# Altium schematic sheet SEP00949AG.SCHDOC
size A3; PageSetup: Record=PageOptions|CenterHorizontal=True|CenterVertical=True|PrintScale=0.73|XCorrection=1.00|YCorrection=1.00|PrintKind=0|BorderSize=5000000|LeftOffset=0|BottomOffset=0|Orientation=2|PaperLength=1000|PaperWidth=1000|Scale=100|PaperSource=7|PrintQuality=-4|MediaType=1|DitherType=10|PaperKind=A4|PrintScaleMode=1
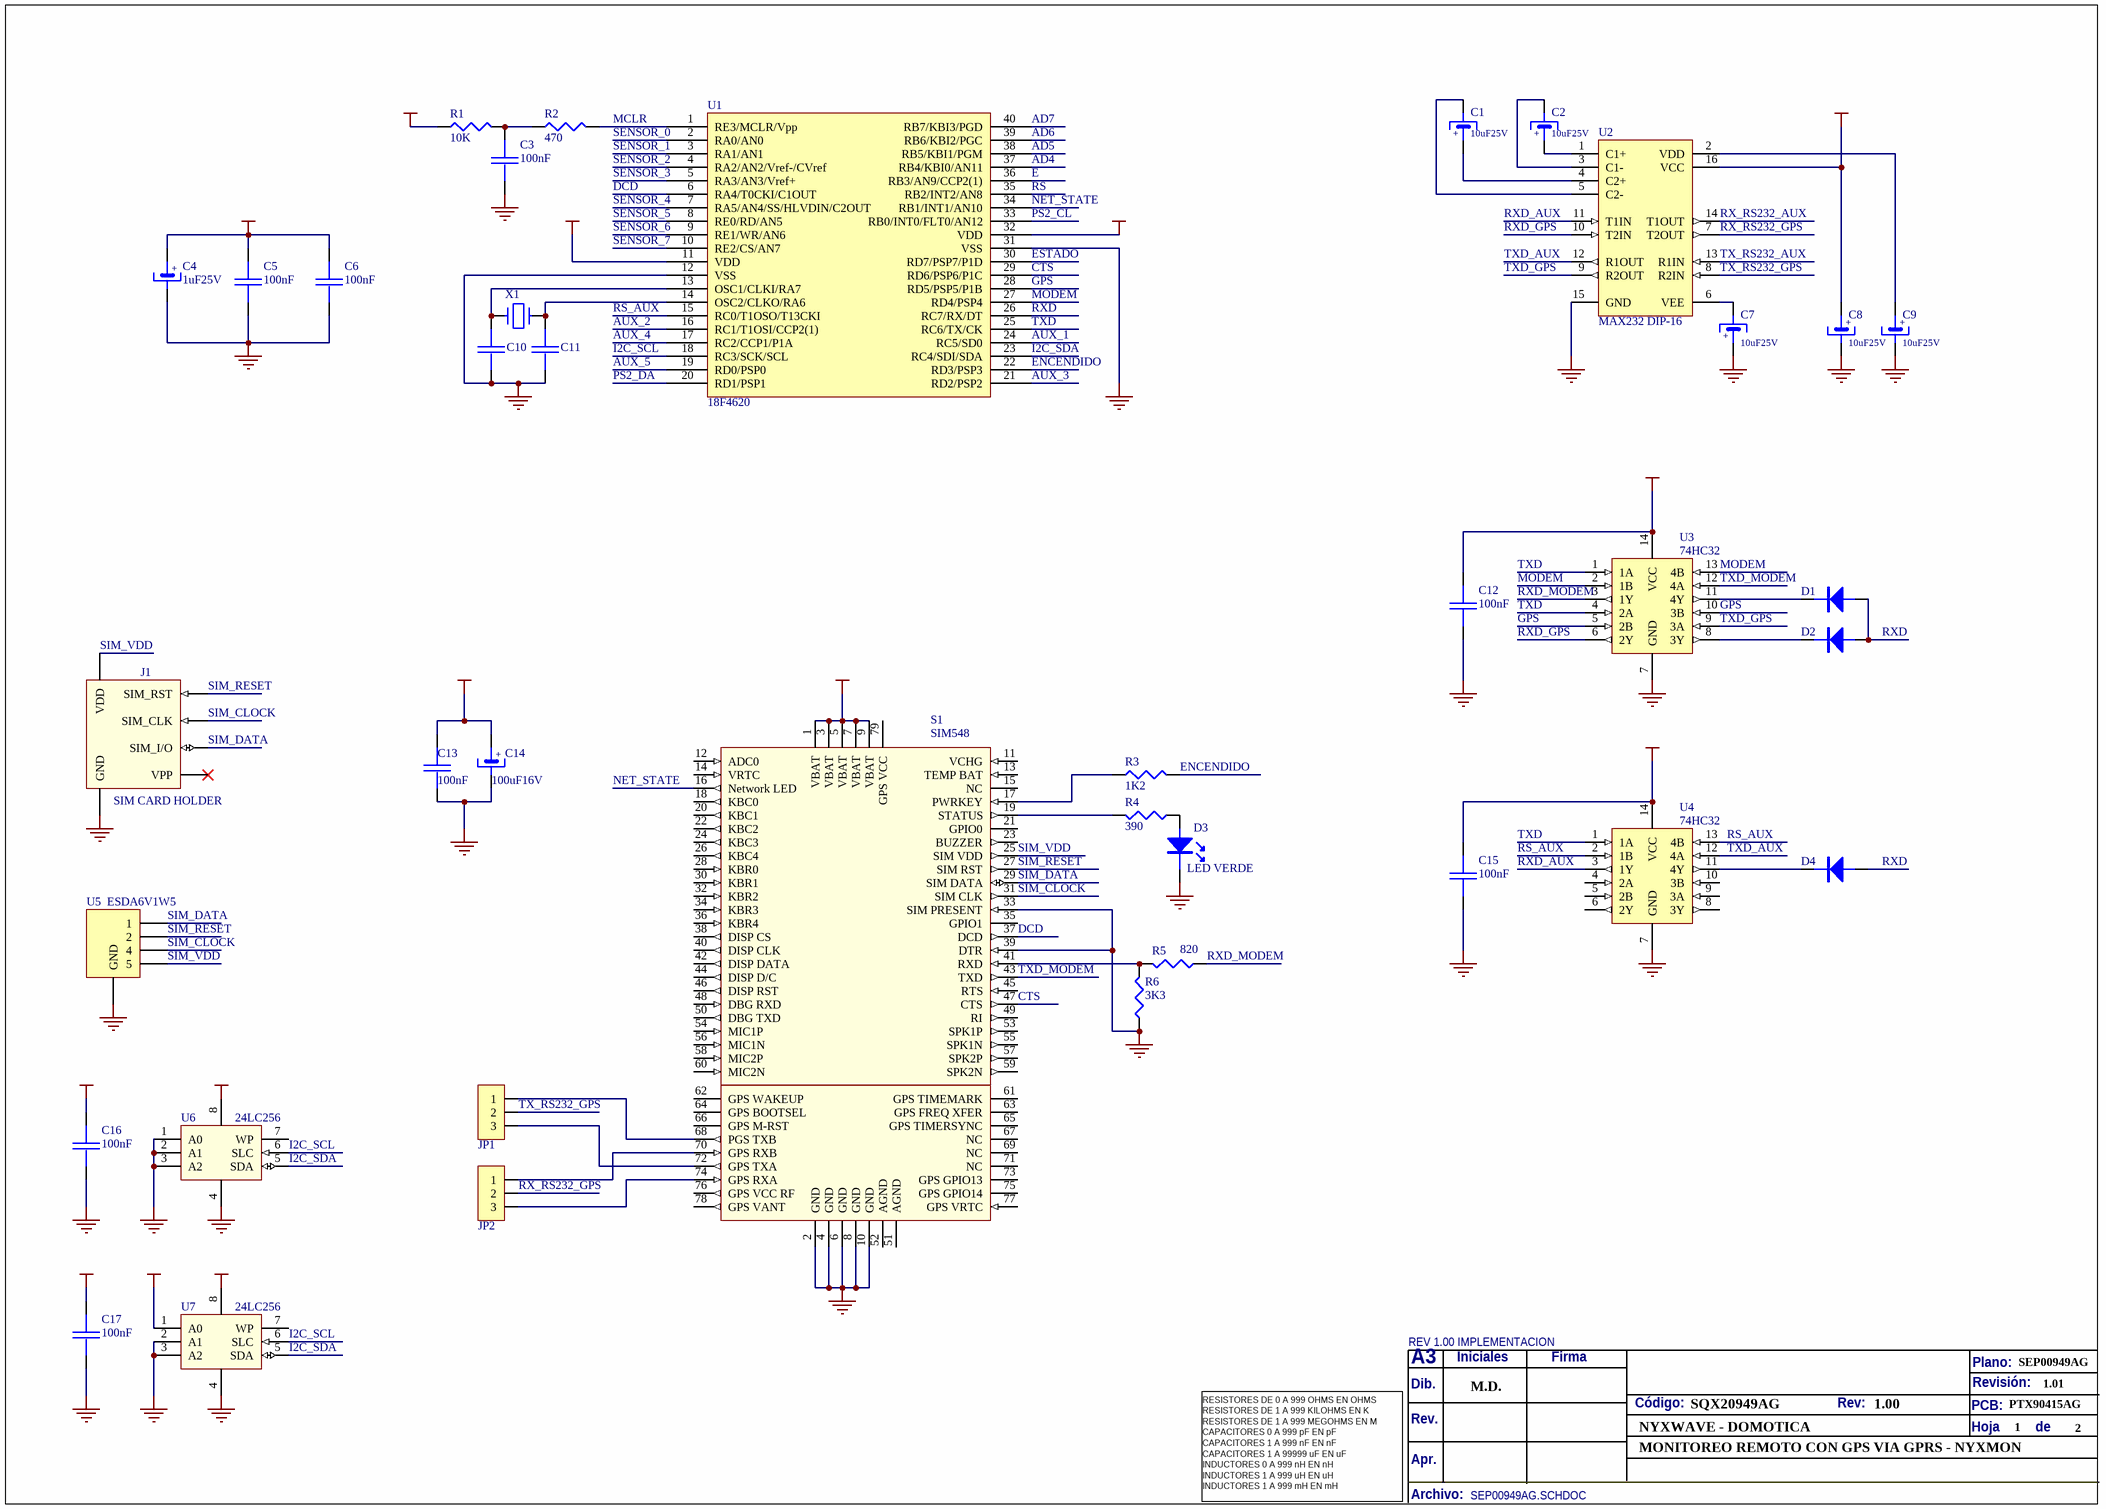
[diagram p0: SEP00949AG.SCHDOC]

## Parts
C1  10uF25V  [CE 2.0/5.0]
C2  10uF25V  [CE 2.0/5.0]
C3  100nF  [0805]
C4  1uF25V  [CE 2.5/5.0]
C5  100nF  [0805]
C6  100nF  [0805]
C7  10uF25V  [CE 2.0/5.0]
C8  10uF25V  [CE 2.0/5.0]
C9  10uF25V  [CE 2.0/5.0]
C10  15p  [CAP2.54]  (value not drawn)
C11  15p  [CAP2.54]  (value not drawn)
C12  100nF  [0805]
C13  100nF  [0805]
C14  100uF16V  [CE 3.5/8.0]
C15  100nF  [0805]
C16  100nF  [0805]
C17  100nF  [0805]
D1  1N4148 DO-35  [DO-35_200]  (value not drawn)
D2  1N4148 DO-35  [DO-35_200]  (value not drawn)
D3  LED VERDE  [LED 3MM]
D4  1N4148 DO-35  [DO-35_200]  (value not drawn)
J1  SIM CARD HOLDER  [SIM CARD HOLDER]
JP1  HEADER3  [JUMPER_3]  (value not drawn)
JP2  HEADER3  [JUMPER_3]  (value not drawn)
R1  10K  [RES_MF1/2W_200]
R2  470  [RES_MF1/2W_200]
R3  1K2  [0805]
R4  390  [RES_MF1/2W_200]
R5  820  [RES_MF1/2W_200]
R6  3K3  [RES_MF1/2W_200]
S1  SIM548  [SIM548]
U1  18F4620  [DIP40]
U2  MAX232 DIP-16  [DIP16]
U3  74HC32  [DIP14]
U4  74HC32  [DIP14]
U5  ESDA6V1W5  [SOT-323-5L]
U6  24LC256  [DIP8]
U7  24LC256  [DIP8]
X1  20MHz  [UM5]  (value not drawn)

## Nets
+5V: C8.1 C12.1 C15.1 C16.2 C17.2 R1.1 U2.16(VCC) U3.14(VCC) U4.14(VCC) U6.8(VCC) U7.1(A0) U7.8(VCC)
GND: C3.1 C4.2 C5.2 C6.1 C7.1 C8.2 C9.2 C10.1 C11.1 C12.2 C13.1 C14.2 C15.2 C16.1 C17.1 D3.K J1.4(GND) R6.1 S1.2(GND) S1.4(GND) S1.6(GND) S1.8(GND) S1.10(GND) S1.33(SIM_PRESENT) S1.39(DTR) U1.12(VSS) U1.31(VSS) U2.15(GND) U3.7(GND) U4.7(GND) U5.3(GND) U6.1(A0) U6.2(A1) U6.3(A2) U6.4(VSS) U7.2(A1) U7.3(A2) U7.4(VSS)
VBAT: C13.2 C14.1 S1.1(VBAT) S1.3(VBAT) S1.5(VBAT) S1.7(VBAT) S1.9(VBAT)
VDD: C4.1 C5.1 C6.2 U1.11(VDD) U1.32(VDD)
AD4: U1.37(RB4/KBI0/AN11)
AD5: U1.38(RB5/KBI1/PGM)
AD6: U1.39(RB6/KBI2/PGC)
AD7: U1.40(RB7/KBI3/PGD)
AUX_1: U1.24(RC5/SD0)
AUX_2: U1.16(RC1/T1OSI/CCP2(1))
AUX_3: U1.21(RD2/PSP2)
AUX_4: U1.17(RC2/CCP1/P1A)
AUX_5: U1.19(RD0/PSP0)
CTS: S1.47(CTS) U1.29(RD6/PSP6/P1C)
DCD: S1.37(DCD) U1.6(RA4/T0CKI/C1OUT)
E: U1.36(RB3/AN9/CCP2(1))
ENCENDIDO: R3.2 U1.22(RD3/PSP3)
ESTADO: U1.30(RD7/PSP7/P1D)
GPS: U1.28(RD5/PSP5/P1B) U3.5(2B) U3.10(3B)
I2C_SCL: U1.18(RC3/SCK/SCL) U6.6(SLC) U7.6(SLC)
I2C_SDA: U1.23(RC4/SDI/SDA) U6.5(SDA) U7.5(SDA)
MCLR: R2.2 U1.1(RE3/MCLR/Vpp)
MODEM: U1.27(RD4/PSP4) U3.2(1B) U3.13(4B)
NET_STATE: S1.16(Network_LED) U1.34(RB1/INT1/AN10)
PS2_CL: U1.33(RB0/INT0/FLT0/AN12)
PS2_DA: U1.20(RD1/PSP1)
RS: U1.35(RB2/INT2/AN8)
RS_AUX: U1.15(RC0/T1OSO/T13CKI) U4.2(1B) U4.13(4B)
RX_RS232_AUX: U2.14(T1OUT)
RX_RS232_GPS: JP2.2 U2.7(T2OUT)
RXD: D1.A D2.A D4.A U1.26(RC7/RX/DT)
RXD_AUX: U2.11(T1IN) U4.3(1Y)
RXD_GPS: U2.10(T2IN) U3.6(2Y)
RXD_MODEM: R5.1 U3.3(1Y)
SENSOR_0: U1.2(RA0/AN0)
SENSOR_1: U1.3(RA1/AN1)
SENSOR_2: U1.4(RA2/AN2/Vref-/CVref)
SENSOR_3: U1.5(RA3/AN3/Vref+)
SENSOR_4: U1.7(RA5/AN4/SS/HLVDIN/C2OUT)
SENSOR_5: U1.8(RE0/RD/AN5)
SENSOR_6: U1.9(RE1/WR/AN6)
SENSOR_7: U1.10(RE2/CS/AN7)
SIM_CLOCK: J1.3(SIM_CLK) S1.31(SIM_CLK) U5.4
SIM_DATA: J1.6(SIM_I/O) S1.29(SIM_DATA) U5.1
SIM_RESET: J1.2(SIM_RST) S1.27(SIM_RST) U5.2
SIM_VDD: J1.1(VDD) S1.25(SIM_VDD) U5.5
TX_RS232_AUX: U2.13(R1IN)
TX_RS232_GPS: JP1.2 U2.8(R2IN)
TXD: U1.25(RC6/TX/CK) U3.1(1A) U3.4(2A) U4.1(1A)
TXD_AUX: U2.12(R1OUT) U4.12(4A)
TXD_GPS: U2.9(R2OUT) U3.9(3A)
TXD_MODEM: S1.43(TXD) U3.12(4A)
NetC1_1: C1.1 U2.4(C2+)
NetC1_2: C1.2 U2.5(C2-)
NetC2_1: C2.1 U2.1(C1+)
NetC2_2: C2.2 U2.3(C1-)
NetC3_2: C3.2 R1.2 R2.1
NetC7_2: C7.2 U2.6(VEE)
NetC9_1: C9.1 U2.2(VDD)
NetC10_2: C10.2 U1.13(OSC1/CLKI/RA7) X1.2
NetC11_2: C11.2 U1.14(OSC2/CLKO/RA6) X1.1
NetD1_K: D1.K U3.11(4Y)
NetD2_K: D2.K U3.8(3Y)
NetD3_A: D3.A R4.1
NetD4_K: D4.K U4.11(4Y)
NetJP1_1: JP1.1 S1.68(PGS_TXB)
NetJP1_3: JP1.3 S1.72(GPS_TXA)
NetJP2_1: JP2.1 S1.70(GPS_RXB)
NetJP2_3: JP2.3 S1.74(GPS_RXA)
NetR3_1: R3.1 S1.17(PWRKEY)
NetR4_2: R4.2 S1.19(STATUS)
NetR5_2: R5.2 R6.2 S1.41(RXD)

Not connected (* = marked no-connect by the designer): J1 5(VPP)*; S1 11(VCHG) 12(ADC0) 13(TEMP_BAT) 14(VRTC) 15(NC) 18(KBC0) 20(KBC1) 21(GPIO0) 22(KBC2) 23(BUZZER) 24(KBC3) 26(KBC4) 28(KBR0) 30(KBR1) 32(KBR2) 34(KBR3) 35(GPIO1) 36(KBR4) 38(DISP_CS) 40(DISP_CLK) 42(DISP_DATA) 44(DISP_D/C) 45(RTS) 46(DISP_RST) 48(DBG_RXD) 49(RI) 50(DBG_TXD) 51(AGND) 52(AGND) 53(SPK1P) 54(MIC1P) 55(SPK1N) 56(MIC1N) 57(SPK2P) 58(MIC2P) 59(SPK2N) 60(MIC2N) 61(GPS_TIMEMARK) 62(GPS_WAKEUP) 63(GPS_FREQ_XFER) 64(GPS_BOOTSEL) 65(GPS_TIMERSYNC) 66(GPS_M-RST) 67(NC) 69(NC) 71(NC) 73(GPS_GPIO13) 75(GPS_GPIO14) 76(GPS_VCC_RF) 77(GPS_VRTC) 78(GPS_VANT) 79(GPS_VCC); U4 4(2A) 5(2B) 6(2Y) 8(3Y) 9(3A) 10(3B); U6 7(WP); U7 7(WP)

## Notes on the sheet
- Labels drawn without touching a wire or pin: 1, 1.00, 1.01, 2, M.D., MONITOREO REMOTO CON GPS VIA GPRS - NYXMON, PTX90415AG, SEP00949AG, SQX20949AG
- REV 1.00 IMPLEMENTACION
- Dib.
- A3
- Iniciales
- Firma
- Plano:
- Revisión:
- Rev.
- Apr.
- Código:
- Rev:
- Hoja          de
- PCB:
- RESISTORES DE 0 A 999 OHMS EN OHMS
  RESISTORES DE 1 A 999 KILOHMS EN K
  RESISTORES DE 1 A 999 MEGOHMS EN M
  CAPACITORES 0 A 999 pF EN pF
  CAPACITORES 1 A 999 nF EN nF
  CAPACITORES 1 A 99999 uF EN uF
  INDUCTORES 0 A 999 nH EN nH
  INDUCTORES 1 A 999 uH EN uH
  INDUCTORES 1 A 999 mH EN mH
- Archivo:
- (in symbol 1uF25V) +
- (in symbol 10uF25V 5X11X2) +
- (in symbol 100uF16V) +

## Library data of the parts
C1 C2 C7-C9 = 10uF25V 5X11X2: CAPACITOR ELECTROLITICO RADIAL 5X11mm PASO 2mm 85ªC +/-20 25V 10uF; CODIGO: YEAF106EBG
C3 C5 C6 C12 C13 C15-C17 = 100n: CAPACITOR SMD 0805 X7R  50 V 100 nF; CODIGO: YSBC104AAG
C4 = 1uF25V: CAP ELECT RAD 1.0UF 25V 5X11MM PASO 2MM 85ºC; CODIGO: YEAF105EBG
C10 C11 = 15p: CAPACITOR CERAMICO DISCO 2.54 mm  X7R  50V  15pF; CODIGO: YCAC150AAG
C14 = 100uF16V: CAP ELECT RADIAL 100UF 16V 6.3X12MM PASO 2.5MM 85ºC 20%; CODIGO: YEAI107DBG
D1 D2 D4 = 1N4148 DO-35: 1N4148 DO-35 DIODO; CODIGO: DR00006ABH
D3 = LED VERDE 3MM: CODIGO: DLRV030XCG
J1 = SIM CARD HOLDER: ZOCALO PARA TARJETA DE MEMORIA SIM; CODIGO: XXX00001XX
JP1 JP2 = HEADER3: TIRA MOLEX 1X40 11MM MACHO RECTA PARA PCB; CODIGO: JNMJLSP40G
R1 = 10K: RESISTOR METAL FILM 0.5 W 5% 10 KILOHMS; CODIGO: RMC00103EG
R2 = 470: RESISTOR METAL FILM 0.5 W 5% 470 OHMS; CODIGO: RMC00471EG
R3 = 1K2: RESISTOR SMD0805 0.125 W 5%  1.2 K OHMS; CODIGO: RSB00122EG
R4 = 390: RESISTOR METAL FILM 0.5 W 5% 390 OHMS; CODIGO: RMC00391EG
R5 = 820: RESISTOR METAL FILM 0.5 W 5% 820 OHMS; CODIGO: RMC00821EG
R6 = 3K3: RESISTOR METAL FILM 0.5 W 5% 3.3 KILOHMS; CODIGO: RMC00332EG
S1 = SIM548 QUAD-BAND GSM/GPRS GPS: SIM340C QUAD-BAND GSM/GPRS GSM850MHz/EGSM900MHz/DCS18000MHz/PCS1900MHz GPS; CODIGO: XXXXXXXXXX
U1 = 18F4620 P/I: PIC Microchip
U2 = MAX232 DIP-16: MAX232 DIP-16 CIRCUITO INTEGRADO; CODIGO: UZ00013AGH
U3 U4 = 74HC08 DIP: 74HC08 DIP-14 QUAD 2-INPUT AND GATE; CODIGO: UD00049AFH
U5 = ESDA6V1W5: ESDA6V1W5 ARRAY  FOR ESD PROTECTION; CODIGO: XXX00003XX
U6 U7 = 24LC256: 256K I2C CMOS Serial EEPROM; CODIGO: XXX00004XX
X1 = CRYSTAL: 20.000 MHZ XL20M-UM5 10PPM CRISTAL; CODIGO: XXAC00012H